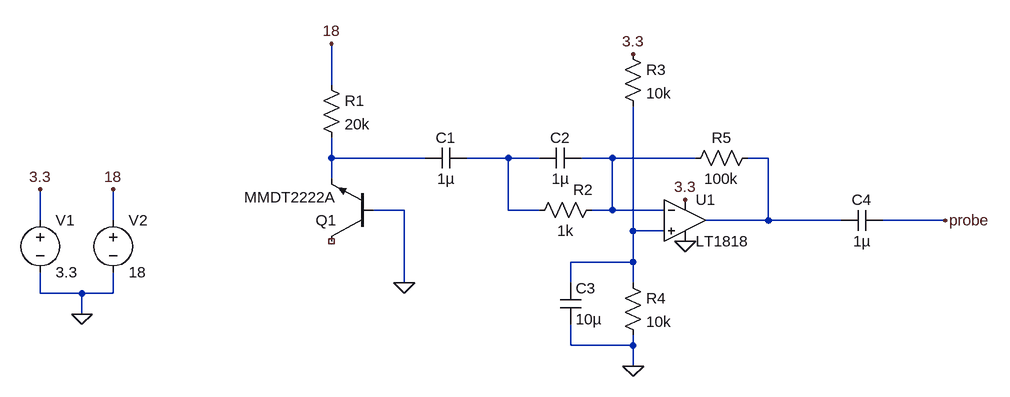
[diagram p0: schematic Good.asc]
Good.asc, the LTspice schematic file:
Version 4
SHEET 1 1508 680
WIRE 480 -80 480 -144
WIRE 480 32 480 0
WIRE 624 32 480 32
WIRE 752 32 688 32
WIRE 800 32 752 32
WIRE 912 32 864 32
WIRE 1040 32 912 32
WIRE 1152 32 1120 32
WIRE 480 64 480 32
WIRE 592 112 544 112
WIRE 752 112 752 32
WIRE 800 112 752 112
WIRE 912 112 912 32
WIRE 912 112 880 112
WIRE 992 112 912 112
WIRE 32 128 32 80
WIRE 144 128 144 80
WIRE 1152 128 1152 32
WIRE 1152 128 1056 128
WIRE 1264 128 1152 128
WIRE 1424 128 1328 128
WIRE 944 144 944 -48
WIRE 992 144 944 144
WIRE 944 192 944 144
WIRE 944 192 848 192
WIRE 592 224 592 112
WIRE 848 224 848 192
WIRE 944 224 944 192
WIRE 32 240 32 208
WIRE 96 240 32 240
WIRE 144 240 144 208
WIRE 144 240 96 240
WIRE 96 272 96 240
WIRE 848 320 848 288
WIRE 944 320 944 304
WIRE 944 320 848 320
WIRE 944 352 944 320
FLAG 96 272 0
FLAG 32 80 3.3
FLAG 144 80 18
FLAG 480 -144 18
FLAG 592 224 0
FLAG 1424 128 probe
FLAG 1024 160 0
FLAG 944 352 0
FLAG 1024 96 3.3
FLAG 944 -128 3.3
SYMBOL voltage 32 112 R0
WINDOW 123 0 0 Left 2
WINDOW 39 0 0 Left 2
SYMATTR InstName V1
SYMATTR Value 3.3
SYMBOL voltage 144 112 R0
WINDOW 123 0 0 Left 2
WINDOW 39 0 0 Left 2
SYMATTR InstName V2
SYMATTR Value 18
SYMBOL npn 544 160 R180
SYMATTR InstName Q1
SYMATTR Value MMDT2222A
SYMBOL res 464 -96 R0
SYMATTR InstName R1
SYMATTR Value 20k
SYMBOL Opamps\\LT1818 1024 128 R0
SYMATTR InstName U1
SYMBOL res 896 96 R90
WINDOW 0 0 29 VBottom 2
WINDOW 3 32 56 VTop 2
SYMATTR InstName R2
SYMATTR Value 1k
SYMBOL cap 688 16 R90
WINDOW 0 0 32 VBottom 2
WINDOW 3 32 32 VTop 2
SYMATTR InstName C1
SYMATTR Value 1µ
SYMBOL cap 864 16 R90
WINDOW 0 0 32 VBottom 2
WINDOW 3 32 32 VTop 2
SYMATTR InstName C2
SYMATTR Value 1µ
SYMBOL res 928 -144 R0
SYMATTR InstName R3
SYMATTR Value 10k
SYMBOL res 928 208 R0
SYMATTR InstName R4
SYMATTR Value 10k
SYMBOL cap 832 224 R0
SYMATTR InstName C3
SYMATTR Value 10µ
SYMBOL cap 1328 112 R90
WINDOW 0 0 32 VBottom 2
WINDOW 3 32 32 VTop 2
SYMATTR InstName C4
SYMATTR Value 1µ
SYMBOL res 1136 16 R90
WINDOW 0 0 56 VBottom 2
WINDOW 3 32 56 VTop 2
SYMATTR InstName R5
SYMATTR Value 100k

The netlist it stands for:
* Good.asc
V1 3.3 0 3.3
V2 18 0 18
Q1 NC_01 0 N001 0 MMDT2222A
R1 18 N001 20k
XU1 N005 N003 N004 3.3 0 LT1818  ; pins In+ In- OUT V+ V-
R2 N003 N002 1k
C1 N002 N001 1µ
C2 N003 N002 1µ
R3 3.3 N005 10k
R4 N005 0 10k
C3 N005 0 10µ
C4 probe N004 1µ
R5 N004 N003 100k
.model NPN NPN
.model PNP PNP
.lib standard.bjt
.lib LTC2.lib
.backanno
.end